# Altium schematic sheet ESP32DevKitC_2024-03-25.schdoc
size 69 x 74 mm
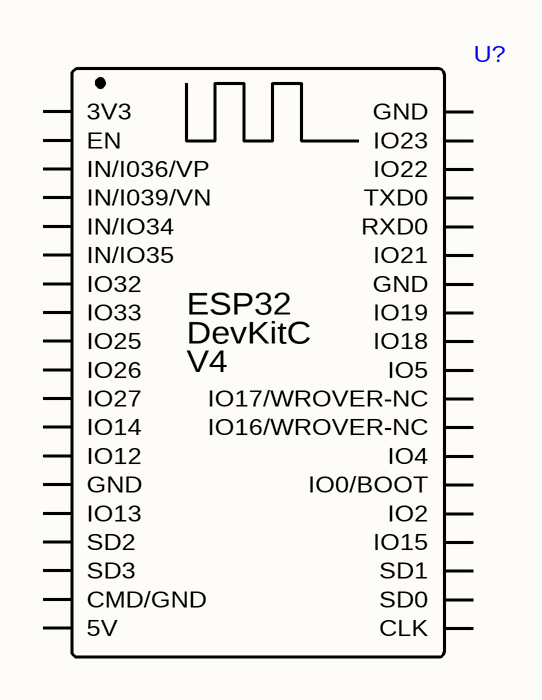
[diagram p0: ESP32DevKitC_2024-03-25.schdoc]

## Parts
U?  (no value)  [ESP32DEVKITC]

## Nets

Not connected (* = marked no-connect by the designer): U? 1(3V3) 2(EN) 3(IN/I036/VP) 4(IN/I039/VN) 5(IN/IO34) 6(IN/IO35) 7(IO32) 8(IO33) 9(IO25) 10(IO26) 11(IO27) 12(IO14) 13(IO12) 14(GND) 15(IO13) 16(SD2) 17(SD3) 18(CMD/GND) 19(5V) 20(CLK) 21(SD0) 22(SD1) 23(IO15) 24(IO2) 25(IO0/BOOT) 26(IO4) 27(IO16/WROVER-NC) 28(IO17/WROVER-NC) 29(IO5) 30(IO18) 31(IO19) 32(GND) 33(IO21) 34(RXD0) 35(TXD0) 36(IO22) 37(IO23) 38(GND)

## Notes on the sheet
- (in symbol ESP32DevKitC) ESP32; DevKitC; V4

## Library data of the parts
U? = ESP32DevKitC